# EAGLE schematic BLEbee-1_0_0-REV-B (EAGLE 6.4)
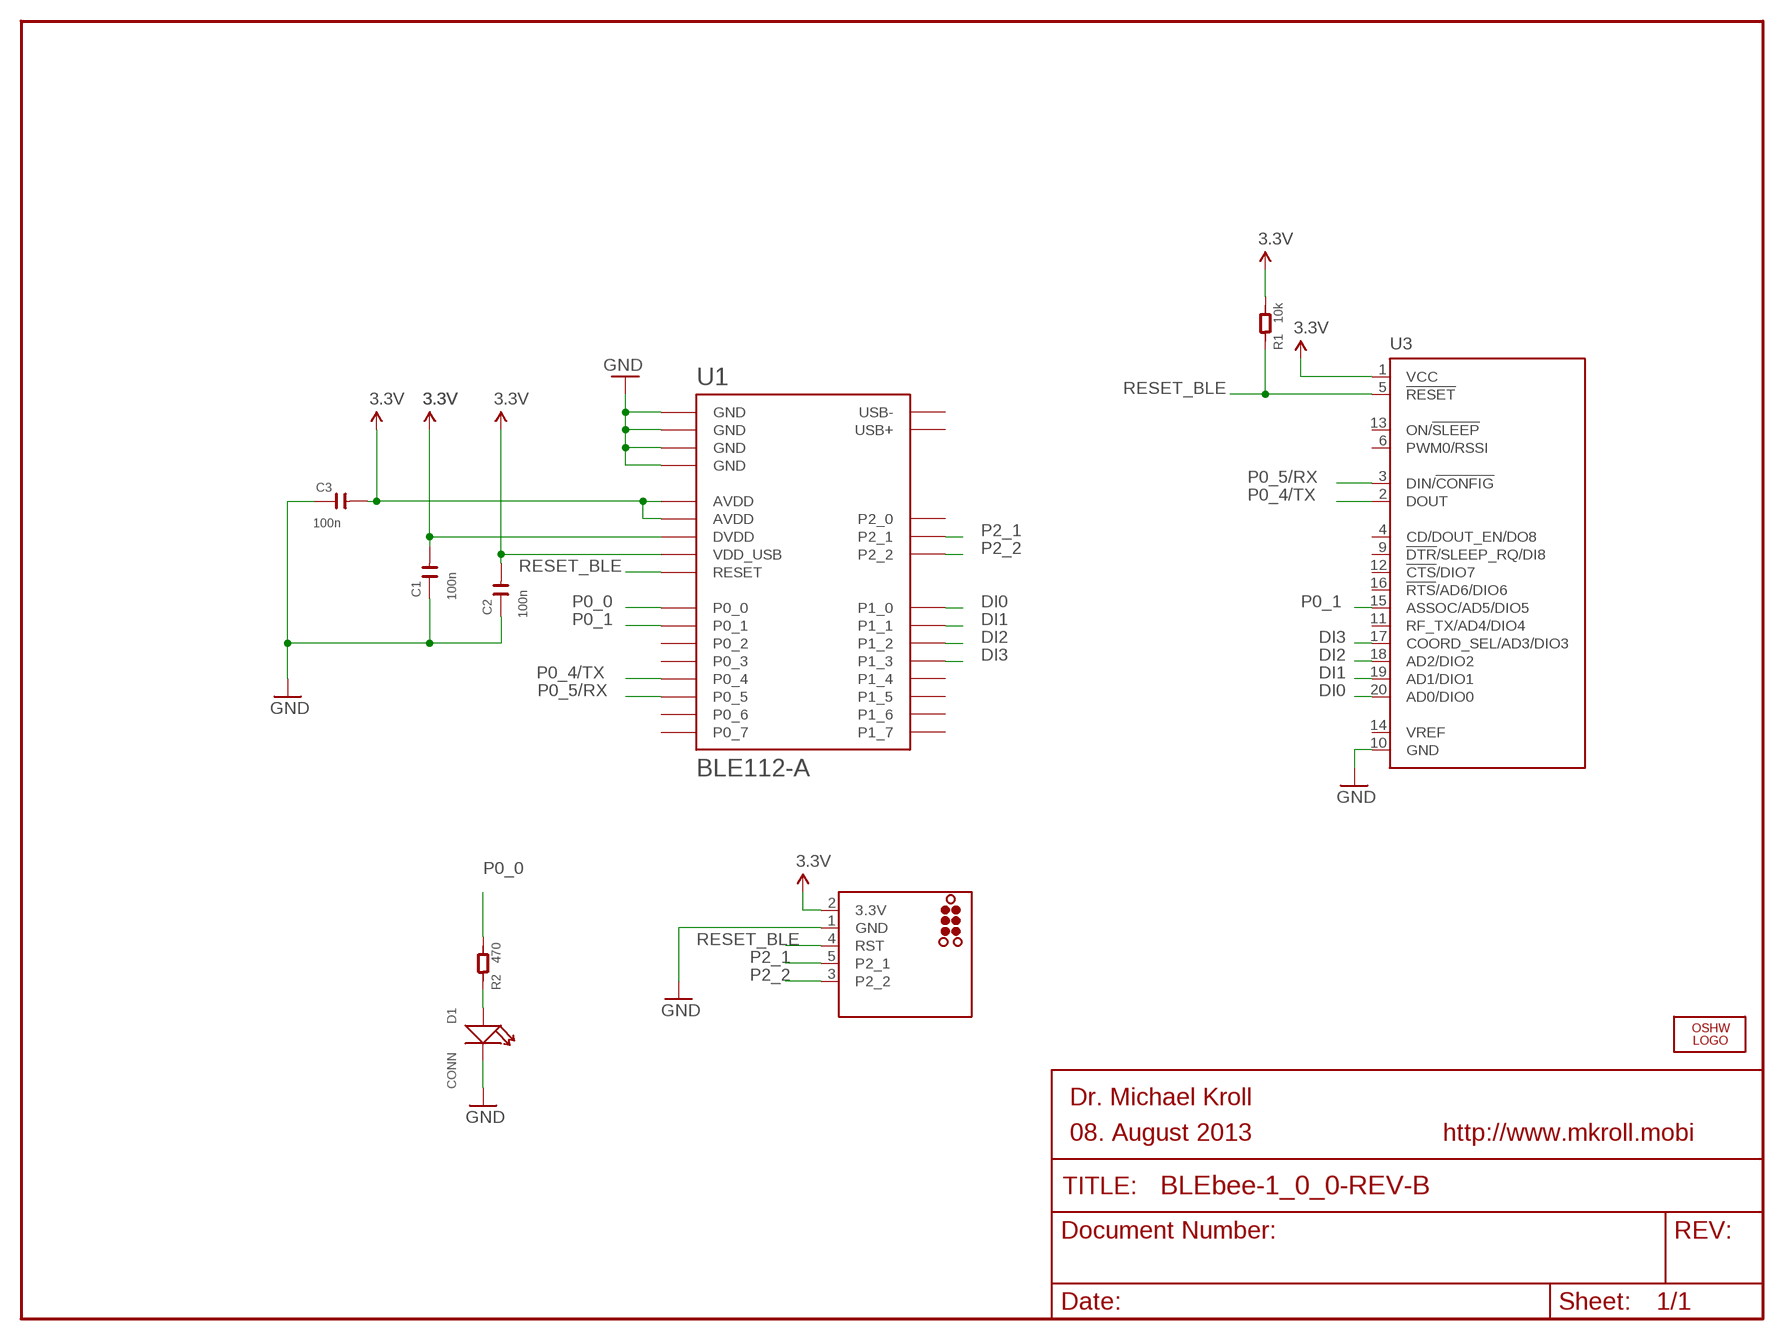
[diagram p0: schematic, sheet 1]

## Parts
C1  100n  C-0603  [C0603]
C2  100n  C-0603  [C0603]
C3  100n  C-0603  [C0603]
D1  CONN  LED  [LED0603]
J1  TC2030-CC-DEBUGGER  [TC2030-MCP-NL]
LOGO1  LOGO-OSHW-6MILX0100-NT  [OSHW_6X100_NOTEXT]
R1  10k  R-0603  [R0603]
R2  470  R-0603  [R0603]
U1  BLE112-A  [BLE112-A]
U3  MODULE_BEE-XBEE-DIP  [MODULE_20P-DIP-2.0-W/-SILK]

## Nets
3.3V: C1.1 C2.1 C3.1 J1.2(3.3V) R1.2 U1.AVDD1(AVDD) U1.AVDD2(AVDD) U1.DVDD U1.VDD_USB U3.1(VCC)
DI0: U1.P1_0 U3.20(AD0/DIO0)
DI1: U1.P1_1 U3.19(AD1/DIO1)
DI2: U1.P1_2 U3.18(AD2/DIO2)
DI3: U1.P1_3 U3.17(COORD_SEL/AD3/DIO3)
GND: C1.2 C2.2 C3.2 D1.- J1.1(GND) U1.GND1(GND) U1.GND2(GND) U1.GND3(GND) U1.GND4(GND) U3.10(GND)
N$1: D1.+ R2.1
P0_0: R2.2 U1.P0_0
P0_1: U1.P0_1 U3.15(ASSOC/AD5/DIO5)
P0_4/TX: U1.P0_4 U3.2(DOUT)
P0_5/RX: U1.P0_5 U3.3(DIN/!CONFIG)
P2_1: J1.5(P2_1) U1.P2_1
P2_2: J1.3(P2_2) U1.P2_2
RESET_BLE: J1.4(RST) R1.1 U1.RESET U3.5(!RESET)
Unconnected: U1.P0_2 U1.P0_3 U1.P0_6 U1.P0_7 U1.P1_4 U1.P1_5 U1.P1_6 U1.P1_7 U1.P2_0 U1.USB+ U1.USB- U3.4(CD/DOUT_EN/DO8) U3.6(PWM0/RSSI) U3.9(!DTR!/SLEEP_RQ/DI8) U3.11(RF_TX/AD4/DIO4) U3.12(!CTS!/DIO7) U3.13(ON/!SLEEP) U3.14(VREF) U3.16(!RTS!/AD6/DIO6)

## Notes on the sheet
- Dr. Michael Kroll
- 08. August 2013 | http://www.mkroll.mobi

## Library data of the parts
C1-C3 = OPL:C*
D1 = OPL:LED*: LED
J1 = Tag-Connect:TC2030-CC-DEBUGGER: Arduino TAG-CONNECT ICSP Connector Manufacturer: Tag-Connect <http://www.tag-connect.com> Cable for easy Arduino In-Circuit Bootloader and Sketch Programming. PAD Description 1 MISO 2 VCC 3 SCK 4 MOSI 5 RST 6 GND ©2013 http://www.mkroll.mobi - modified and updated by Dr. Michael Kroll ‹dr.michael.kroll@gmail.com›
LOGO1 = Logo:LOGO-OSHW-6MIL
R1 R2 = OPL:R*
U1 = sf-bluegiga:BLE112-A: Bluetooth Low Energy single-mode module - Bluetooth 4.0, chip antenna
U3 = BLEbee-1_0_0-REV-B:MODULE_BEE-XBEE: XBee (TM) /XBee-PRO(TM) OEM RF Modules Source: MaxStream, Inc. xbee_productmanual.pdf